# Altium schematic sheet main_stack_dual_channel.SchDoc
size A
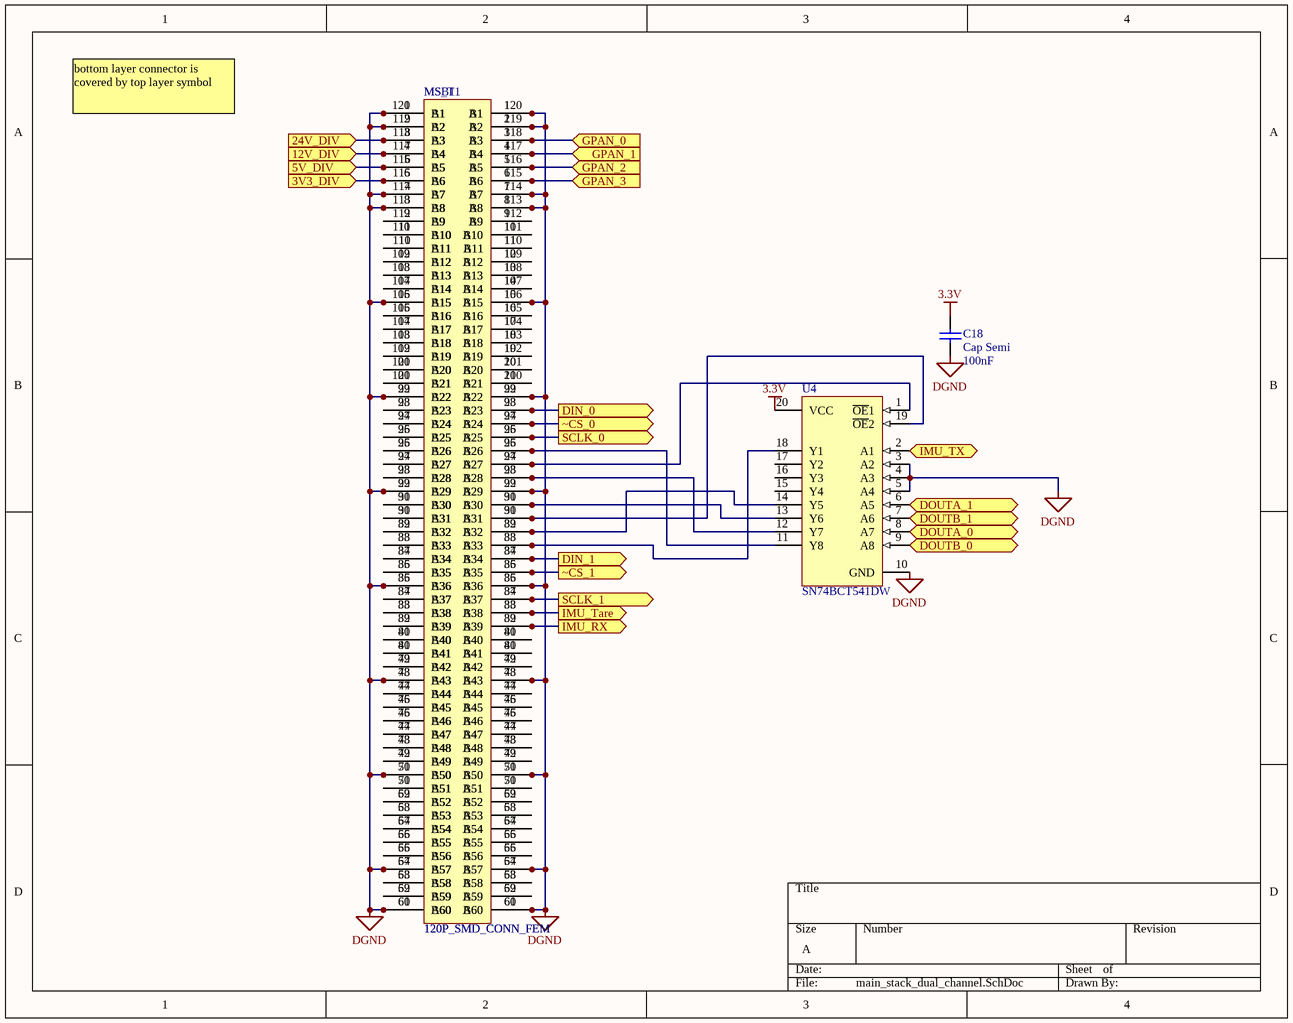
[diagram p0: main_stack_dual_channel.SchDoc]

## Parts
C18  Cap Semi  value 100nF  [C0805]
MS_T1  120P_SMD_CONN_FEM  [FX2-120P-1.27SV]
MSB1  120P_SMD_CONN_FEM  [FX2-120P-1.27SV]
U4  SN74BCT541DW  [DW020]

## Ports
3V3_DIV (in), 5V_DIV (in), 12V_DIV (in), 24V_DIV (in), DIN_0 (out), DIN_1 (out), DOUTA_0 (in), DOUTA_1 (in), DOUTB_0 (in), DOUTB_1 (in), GPAN_0 (in), GPAN_1 (in), GPAN_2 (in), GPAN_3 (in), IMU_RX (out), IMU_Tare (out), IMU_TX (in), SCLK_0 (out), SCLK_1 (out), ~CS_0 (out), ~CS_1 (out)

## Nets
3.3V: C18.2 U4.20(VCC)
DGND: C18.1 MS_T1.1(A1) MS_T1.2(A2) MS_T1.7(A7) MS_T1.8(A8) MS_T1.15(A15) MS_T1.22(A22) MS_T1.29(A29) MS_T1.36(A36) MS_T1.43(A43) MS_T1.50(A50) MS_T1.57(A57) MS_T1.60(A60) MS_T1.61(B60) MS_T1.64(B57) MS_T1.71(B50) MS_T1.78(B43) MS_T1.85(B36) MS_T1.92(B29) MS_T1.99(B22) MS_T1.106(B15) MS_T1.113(B8) MS_T1.114(B7) MS_T1.119(B2) MS_T1.120(B1) MSB1.1(A1) MSB1.2(A2) MSB1.7(A7) MSB1.8(A8) MSB1.15(A15) MSB1.22(A22) MSB1.29(A29) MSB1.36(A36) MSB1.43(A43) MSB1.50(A50) MSB1.57(A57) MSB1.60(A60) MSB1.61(B60) MSB1.64(B57) MSB1.71(B50) MSB1.78(B43) MSB1.85(B36) MSB1.92(B29) MSB1.99(B22) MSB1.106(B15) MSB1.113(B8) MSB1.114(B7) MSB1.119(B2) MSB1.120(B1) U4.3(A2) U4.4(A3) U4.5(A4) U4.10(GND)
3V3_DIV: MS_T1.6(A6) MSB1.115(B6) ; port 3V3_DIV
5V_DIV: MS_T1.5(A5) MSB1.116(B5) ; port 5V_DIV
12V_DIV: MS_T1.4(A4) MSB1.117(B4) ; port 12V_DIV
24V_DIV: MS_T1.3(A3) MSB1.118(B3) ; port 24V_DIV
DIN_0: MS_T1.98(B23) MSB1.23(A23) ; port DIN_0
DIN_1: MS_T1.87(B34) MSB1.34(A34) ; port DIN_1
DOUTA_0: U4.8(A7) ; port DOUTA_0
DOUTA_1: U4.6(A5) ; port DOUTA_1
DOUTB_0: U4.9(A8) ; port DOUTB_0
DOUTB_1: U4.7(A6) ; port DOUTB_1
GPAN_0: MS_T1.118(B3) MSB1.3(A3) ; port GPAN_0
GPAN_1: MS_T1.117(B4) MSB1.4(A4) ; port GPAN_1
GPAN_2: MS_T1.116(B5) MSB1.5(A5) ; port GPAN_2
GPAN_3: MS_T1.115(B6) MSB1.6(A6) ; port GPAN_3
IMU_RX: MS_T1.82(B39) MSB1.39(A39) ; port IMU_RX
IMU_Tare: MS_T1.83(B38) MSB1.38(A38) ; port IMU_Tare
IMU_TX: U4.2(A1) ; port IMU_TX
SCLK_0: MS_T1.96(B25) MSB1.25(A25) ; port SCLK_0
SCLK_1: MS_T1.84(B37) MSB1.37(A37) ; port SCLK_1
~CS_0: MS_T1.97(B24) MSB1.24(A24) ; port ~CS_0
~CS_1: MS_T1.86(B35) MSB1.35(A35) ; port ~CS_1
NetMS_T1_9: MS_T1.9(A9) MSB1.112(B9)
NetMS_T1_10: MS_T1.10(A10) MSB1.111(B10)
NetMS_T1_11: MS_T1.11(A11) MSB1.110(B11)
NetMS_T1_12: MS_T1.12(A12) MSB1.109(B12)
NetMS_T1_13: MS_T1.13(A13) MSB1.108(B13)
NetMS_T1_14: MS_T1.14(A14) MSB1.107(B14)
NetMS_T1_16: MS_T1.16(A16) MSB1.105(B16)
NetMS_T1_17: MS_T1.17(A17) MSB1.104(B17)
NetMS_T1_18: MS_T1.18(A18) MSB1.103(B18)
NetMS_T1_19: MS_T1.19(A19) MSB1.102(B19)
NetMS_T1_20: MS_T1.20(A20) MSB1.101(B20)
NetMS_T1_21: MS_T1.21(A21) MSB1.100(B21)
NetMS_T1_23: MS_T1.23(A23) MSB1.98(B23)
NetMS_T1_24: MS_T1.24(A24) MSB1.97(B24)
NetMS_T1_25: MS_T1.25(A25) MSB1.96(B25)
NetMS_T1_26: MS_T1.26(A26) MSB1.95(B26)
NetMS_T1_27: MS_T1.27(A27) MSB1.94(B27)
NetMS_T1_28: MS_T1.28(A28) MSB1.93(B28)
NetMS_T1_30: MS_T1.30(A30) MSB1.91(B30)
NetMS_T1_31: MS_T1.31(A31) MSB1.90(B31)
NetMS_T1_32: MS_T1.32(A32) MSB1.89(B32)
NetMS_T1_33: MS_T1.33(A33) MSB1.88(B33)
NetMS_T1_34: MS_T1.34(A34) MSB1.87(B34)
NetMS_T1_35: MS_T1.35(A35) MSB1.86(B35)
NetMS_T1_37: MS_T1.37(A37) MSB1.84(B37)
NetMS_T1_38: MS_T1.38(A38) MSB1.83(B38)
NetMS_T1_39: MS_T1.39(A39) MSB1.82(B39)
NetMS_T1_40: MS_T1.40(A40) MSB1.81(B40)
NetMS_T1_41: MS_T1.41(A41) MSB1.80(B41)
NetMS_T1_42: MS_T1.42(A42) MSB1.79(B42)
NetMS_T1_44: MS_T1.44(A44) MSB1.77(B44)
NetMS_T1_45: MS_T1.45(A45) MSB1.76(B45)
NetMS_T1_46: MS_T1.46(A46) MSB1.75(B46)
NetMS_T1_47: MS_T1.47(A47) MSB1.74(B47)
NetMS_T1_48: MS_T1.48(A48) MSB1.73(B48)
NetMS_T1_49: MS_T1.49(A49) MSB1.72(B49)
NetMS_T1_51: MS_T1.51(A51) MSB1.70(B51)
NetMS_T1_52: MS_T1.52(A52) MSB1.69(B52)
NetMS_T1_53: MS_T1.53(A53) MSB1.68(B53)
NetMS_T1_54: MS_T1.54(A54) MSB1.67(B54)
NetMS_T1_55: MS_T1.55(A55) MSB1.66(B55)
NetMS_T1_56: MS_T1.56(A56) MSB1.65(B56)
NetMS_T1_58: MS_T1.58(A58) MSB1.63(B58)
NetMS_T1_59: MS_T1.59(A59) MSB1.62(B59)
NetMS_T1_62: MS_T1.62(B59) MSB1.59(A59)
NetMS_T1_63: MS_T1.63(B58) MSB1.58(A58)
NetMS_T1_65: MS_T1.65(B56) MSB1.56(A56)
NetMS_T1_66: MS_T1.66(B55) MSB1.55(A55)
NetMS_T1_67: MS_T1.67(B54) MSB1.54(A54)
NetMS_T1_68: MS_T1.68(B53) MSB1.53(A53)
NetMS_T1_69: MS_T1.69(B52) MSB1.52(A52)
NetMS_T1_70: MS_T1.70(B51) MSB1.51(A51)
NetMS_T1_72: MS_T1.72(B49) MSB1.49(A49)
NetMS_T1_73: MS_T1.73(B48) MSB1.48(A48)
NetMS_T1_74: MS_T1.74(B47) MSB1.47(A47)
NetMS_T1_75: MS_T1.75(B46) MSB1.46(A46)
NetMS_T1_76: MS_T1.76(B45) MSB1.45(A45)
NetMS_T1_77: MS_T1.77(B44) MSB1.44(A44)
NetMS_T1_79: MS_T1.79(B42) MSB1.42(A42)
NetMS_T1_80: MS_T1.80(B41) MSB1.41(A41)
NetMS_T1_81: MS_T1.81(B40) MSB1.40(A40)
NetMS_T1_88: MS_T1.88(B33) MSB1.33(A33) U4.18(Y1)
NetMS_T1_89: MS_T1.89(B32) MSB1.32(A32) U4.14(Y5)
NetMS_T1_90: MS_T1.90(B31) MSB1.31(A31) U4.19(~{OE}2)
NetMS_T1_91: MS_T1.91(B30) MSB1.30(A30) U4.13(Y6)
NetMS_T1_93: MS_T1.93(B28) MSB1.28(A28) U4.12(Y7)
NetMS_T1_94: MS_T1.94(B27) MSB1.27(A27) U4.1(~{OE}1)
NetMS_T1_95: MS_T1.95(B26) MSB1.26(A26) U4.11(Y8)
NetMS_T1_100: MS_T1.100(B21) MSB1.21(A21)
NetMS_T1_101: MS_T1.101(B20) MSB1.20(A20)
NetMS_T1_102: MS_T1.102(B19) MSB1.19(A19)
NetMS_T1_103: MS_T1.103(B18) MSB1.18(A18)
NetMS_T1_104: MS_T1.104(B17) MSB1.17(A17)
NetMS_T1_105: MS_T1.105(B16) MSB1.16(A16)
NetMS_T1_107: MS_T1.107(B14) MSB1.14(A14)
NetMS_T1_108: MS_T1.108(B13) MSB1.13(A13)
NetMS_T1_109: MS_T1.109(B12) MSB1.12(A12)
NetMS_T1_110: MS_T1.110(B11) MSB1.11(A11)
NetMS_T1_111: MS_T1.111(B10) MSB1.10(A10)
NetMS_T1_112: MS_T1.112(B9) MSB1.9(A9)

Not connected (* = marked no-connect by the designer): U4 15(Y4) 16(Y3) 17(Y2)

## Notes on the sheet
- bottom layer connector is covered by top layer symbol

## Library data of the parts
C18 = Cap Semi: Capacitor (Semiconductor SIM Model); Published: 8-Jun-2000; LatestRevisionDate: 29-May-2009; LatestRevisionNote: IPC-7351 Footprint Added.; PackageReference: C1206; Publisher: Altium Limited; PackageDescription: Chip Capacitor
MS_T1 MSB1 = 120P_SMD_CONN_FEM: Main Stack Connector, Female; Part Number: FX2-120P-1.27SV(71)
  MSB1: Datasheet: http://www.hirose.co.jp/cataloge_hp/e57220088.pdf
U4 = SN74BCT541DW: Octal Buffer/Driver with 3-State Outputs; ComponentAvailability: Obsolete; Published: 8-Jun-2000; LatestRevisionDate: 13-Apr-2006; LatestRevisionNote: IPC-7351 Footprint Added.; DatasheetVersion: Apr-1994; PackageVersion: Mar-2000; PackageReference: DW020; Publisher: Altium Limited; PackageDescription: 20-Pin Plastic Small Outline Integrated Circuit 1.27 mm Pitch; Code_JEDEC: MS-013; Code_IPC: SOIC127P1030-20; ComponentLink1Description: Manufacturer Link; ComponentLink1URL: http://www.ti.com/; ComponentLink2Description: Discontinuation Notice; ComponentLink2URL: http://focus.ti.com/docs/prod/folders/print/sn74bct541.html; Datasheet: http://www.ti.com/lit/ds/symlink/sn74bct541a.pdf; Digikey PN: 296-33840-5-ND